# Altium schematic sheet 2008_SablierElectronique_SCH.SchDoc
size A3; Version: A; Author: Carlos  Reyes Peña; Organization: ETML-ES; Address1: Avenue Recordon 1; Address2: 1004 Lausanne; Address3: Switzerland; Revision: 1; SheetNumber: 1; SheetTotal: 4
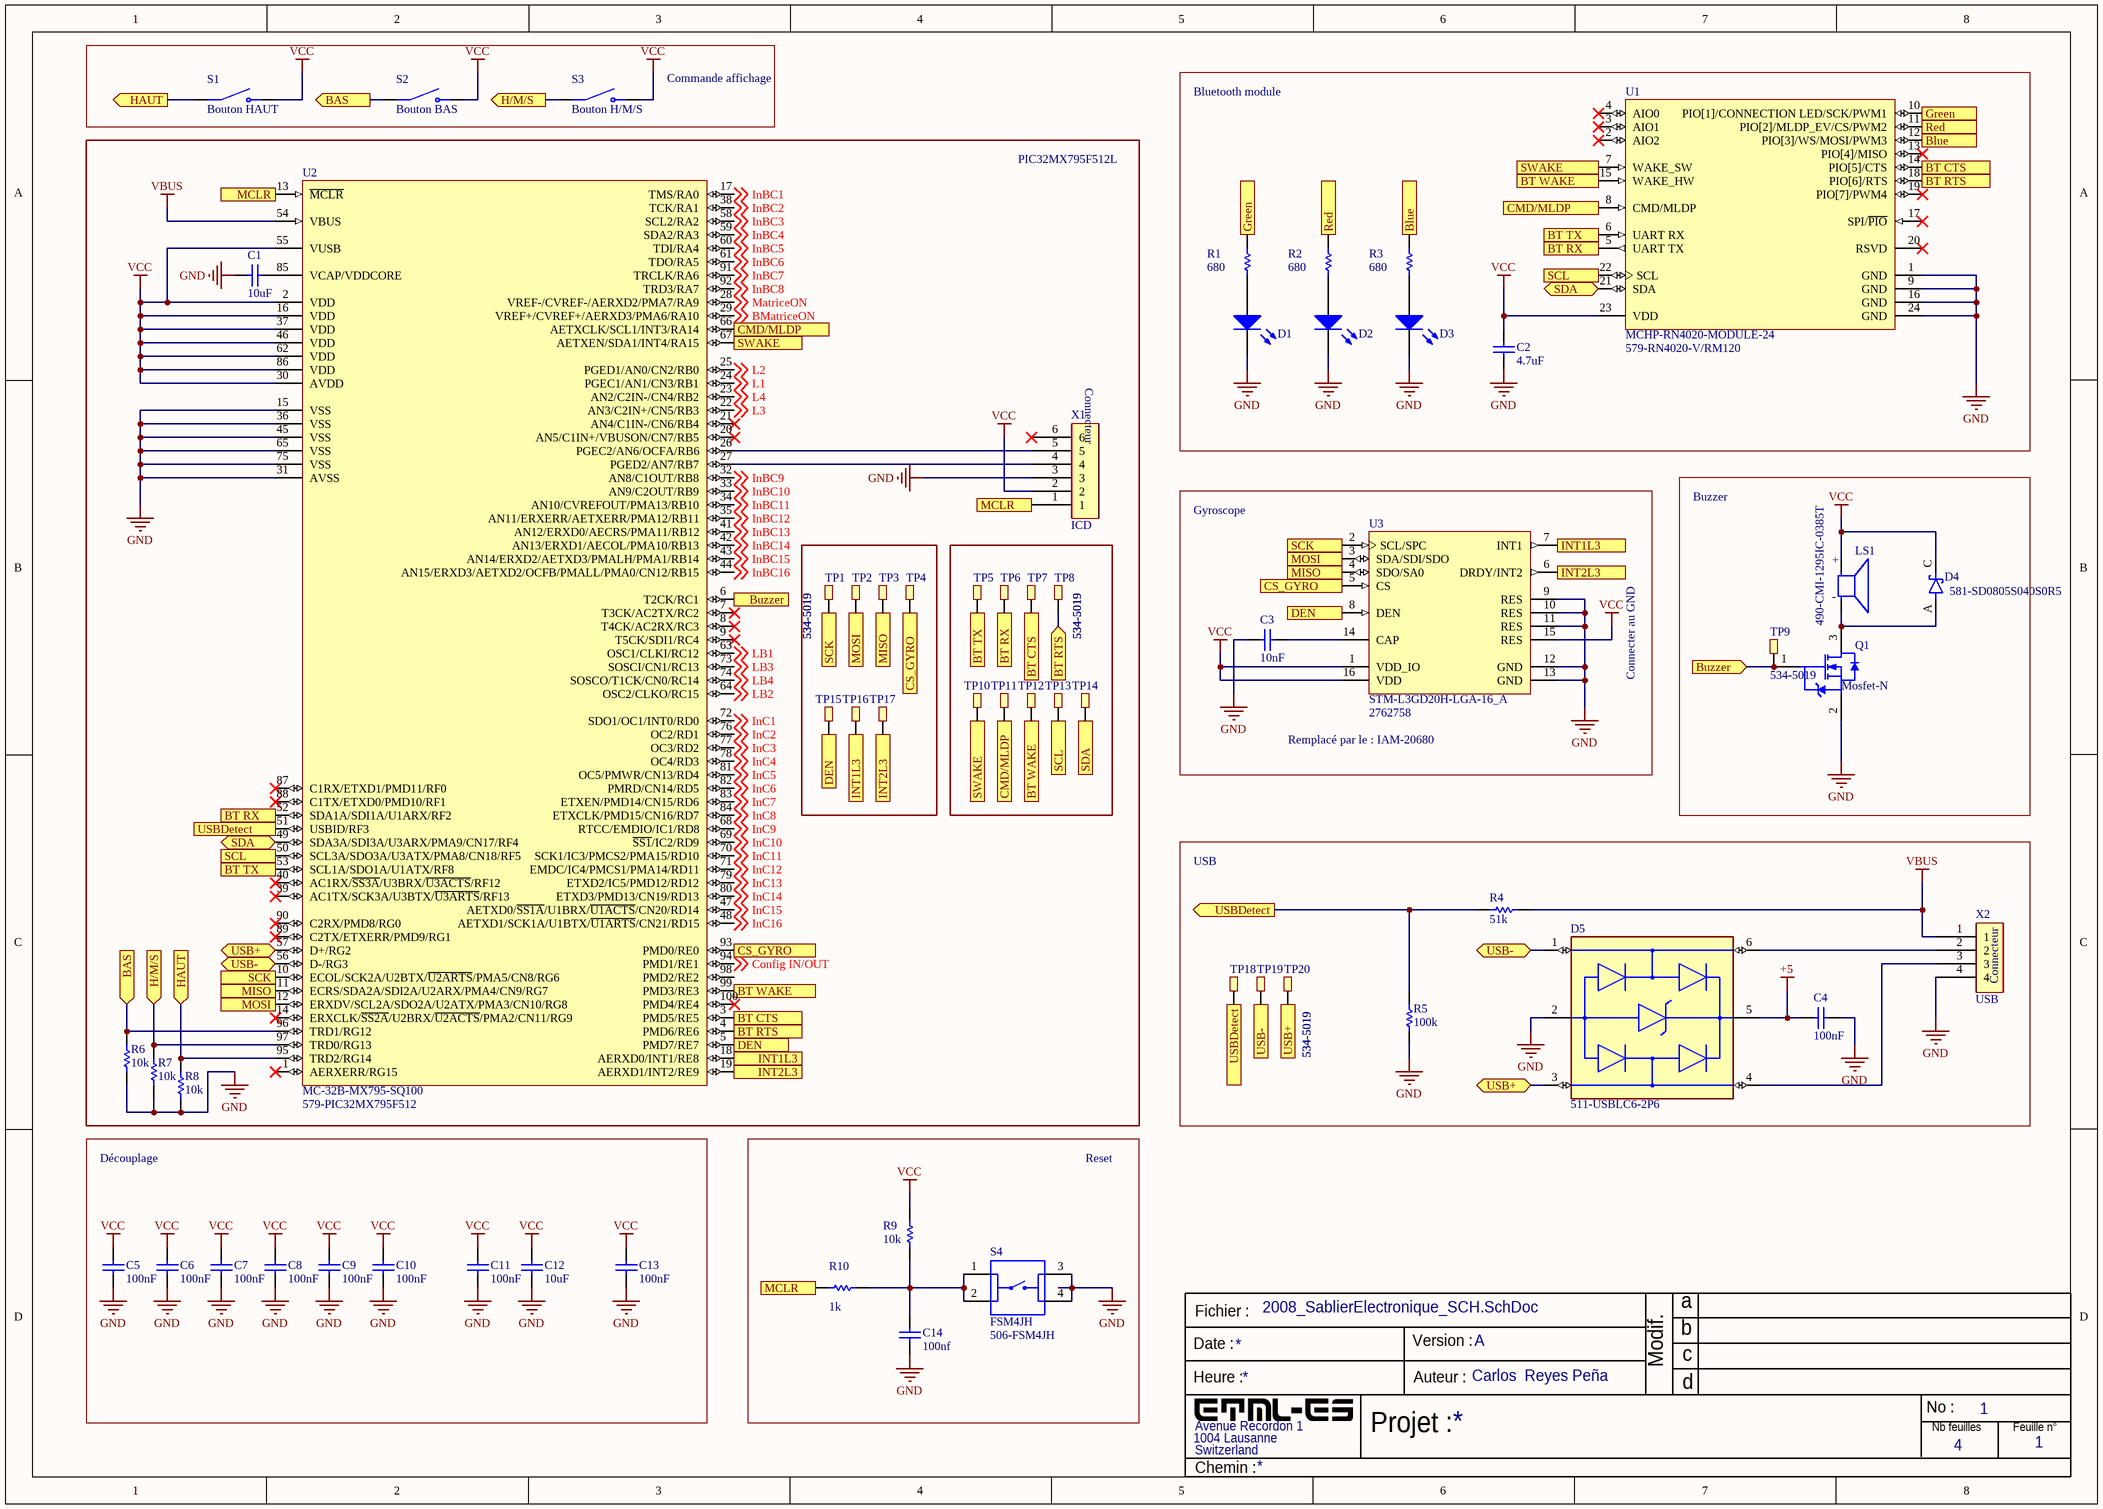
[diagram p0: 2008_SablierElectronique_SCH.SchDoc]

## Parts
C1  10uF  [RESC0805(2012)_L]
C2  4.7uF  [RESC0805(2012)_L]
C3  10nF  [RESC0805(2012)_L]
C4  100nF  [RESC0805(2012)_L]
C5  100nF  [RESC0805(2012)_L]
C6  100nF  [RESC0805(2012)_L]
C7  100nF  [RESC0805(2012)_L]
C8  100nF  [RESC0805(2012)_L]
C9  100nF  [RESC0805(2012)_L]
C10  100nF  [RESC0805(2012)_L]
C11  100nF  [RESC0805(2012)_L]
C12  10uF  [RESC0805(2012)_L]
C13  100nF  [RESC0805(2012)_L]
C14  100nf  [RESC0805(2012)_L]
D1  KPT-2012SRC-PRV  [0805_LED]  (value not drawn)
D2  KPT-2012SRC-PRV  [0805_LED]  (value not drawn)
D3  KPT-2012SRC-PRV  [0805_LED]  (value not drawn)
D4  Supplier Part Number 1: 581-SD0805S040S0R5  [DIOSC130X200X100-2N]  (hidden comment: SD0805S040S0R1)
D5  Supplier Part Number 1: 511-USBLC6-2P6  [FP-SOT-666-MFG]  (hidden comment: USBLC6-2P6)
LS1  Supplier Part Number 1: 490-CMI-1295IC-0385T  [CUI_CMI-1295IC-0385T]  (hidden comment: CMI-1295IC-0385T)
Q1  Mosfet-N  [FAIR-SOT23-3_V]
R1  680  [RESC0805(2012)_L]
R2  680  [RESC0805(2012)_L]
R3  680  [RESC0805(2012)_L]
R4  51k  [RESC0805(2012)_L]
R5  100k  [RESC0805(2012)_L]
R6  10k  [RESC0805(2012)_L]
R7  10k  [RESC0805(2012)_L]
R8  10k  [RESC0805(2012)_L]
R9  10k  [RESC0805(2012)_L]
R10  1k  [RESC0805(2012)_L]
S1  Bouton HAUT  [Header 2 pin]
S2  Bouton BAS  [Header 2 pin]
S3  Bouton H/M/S  [Header 2 pin]
S4  FSM4JH  Supplier Part Number 1: 506-FSM4JH  [SW_FSM4JH]
TP1  Supplier Part Number 1: 534-5019  [TESTPOINT_SMD]  (hidden comment: 5019)
TP2  Supplier Part Number 1: 534-5019  [TESTPOINT_SMD]  (hidden comment: 5019)
TP3  Supplier Part Number 1: 534-5019  [TESTPOINT_SMD]  (hidden comment: 5019)
TP4  Supplier Part Number 1: 534-5019  [TESTPOINT_SMD]  (hidden comment: 5019)
TP5  Supplier Part Number 1: 534-5019  [TESTPOINT_SMD]  (hidden comment: 5019)
TP6  Supplier Part Number 1: 534-5019  [TESTPOINT_SMD]  (hidden comment: 5019)
TP7  Supplier Part Number 1: 534-5019  [TESTPOINT_SMD]  (hidden comment: 5019)
TP8  Supplier Part Number 1: 534-5019  [TESTPOINT_SMD]  (hidden comment: 5019)
TP9  Supplier Part Number 1: 534-5019  [TESTPOINT_SMD]  (hidden comment: 5019)
TP10  5019  [TESTPOINT_SMD_Via]  (value not drawn)
TP11  5019  [TESTPOINT_SMD_Via]  (value not drawn)
TP12  5019  [TESTPOINT_SMD_Via]  (value not drawn)
TP13  5019  [TESTPOINT_SMD_Via]  (value not drawn)
TP14  5019  [TESTPOINT_SMD_Via]  (value not drawn)
TP15  5019  [TESTPOINT_SMD_Via]  (value not drawn)
TP16  5019  [TESTPOINT_SMD_Via]  (value not drawn)
TP17  5019  [TESTPOINT_SMD_Via]  (value not drawn)
TP18  Supplier Part Number 1: 534-5019  [TESTPOINT_SMD]  (hidden comment: 5019)
TP19  Supplier Part Number 1: 534-5019  [TESTPOINT_SMD]  (hidden comment: 5019)
TP20  Supplier Part Number 1: 534-5019  [TESTPOINT_SMD]  (hidden comment: 5019)
U1  MCHP-RN4020-MODULE-24  Supplier Part Number 1: 579-RN4020-V/RM120  [MCHP-MODULE-24_V]
U2  MC-32B-MX795-SQ100  Supplier Part Number 1: 579-PIC32MX795F512  [TQFP-PT100_N]
U3  STM-L3GD20H-LGA-16_A  Supplier Part Number 1: 2762758  [STM-LGA-16]
X1  ICD  [CON6]
X2  USB  [CON4]

## Blocks framed on the sheet
Commande affichage: S1-S3
Bluetooth module: C2 D1-D3 R1-R3 U1
PIC32MX795F512L: C1 R6-R8 TP1-TP8 TP10-TP17 U2 X1
Buzzer: D4 LS1 Q1 TP9
USB: C4 D5 R4 R5 TP18-TP20 X2
Découplage: C5-C13
Reset: C14 R9 R10 S4

## Ports
BAS (in), BAS (out), Blue (in), Blue (out), BT CTS (in), BT CTS (out), BT RTS (in), BT RTS (out), BT RX (in), BT RX (out), BT TX (in), BT TX (out), BT WAKE (in), BT WAKE (out), Buzzer (in), Buzzer (out), CMD/MLDP (in), CMD/MLDP (out), CS_GYRO (in), CS_GYRO (out), DEN (in), DEN (out), Green (in), Green (out), H/M/S (in), H/M/S (out), HAUT (in), HAUT (out), INT1L3 (in), INT1L3 (out), INT2L3 (in), INT2L3 (out), MCLR (in), MCLR (out), MISO (in), MISO (out), MOSI (in), MOSI (out), Red (in), Red (out), SCK (in), SCK (out), SCL (in), SCL (out), SDA (bidir), SDA (in), SWAKE (in), SWAKE (out), USB+ (bidir), USB+ (in), USB- (bidir), USB- (in), USBDetect (in), USBDetect (out)

## Nets
+5: C4.2 D5.5(VBUS)
GND: C1.2 C2.1 C3.1 C4.1 C5.1 C6.1 C7.1 C8.1 C9.1 C10.1 C11.1 C12.1 C13.1 C14.1 D1.1(K) D2.1(K) D3.1(K) D5.2(GND) Q1.2(S) R5.2 R6.2 R7.2 R8.2 S4.3 S4.4 U1.1(GND) U1.9(GND) U1.16(GND) U1.24(GND) U2.15(VSS) U2.31(AVSS) U2.36(VSS) U2.45(VSS) U2.65(VSS) U2.75(VSS) U3.9(RES) U3.10(RES) U3.11(RES) U3.12(GND) U3.13(GND) X1.3 X2.4
VBUS: R4.2 U2.54(VBUS) X2.1
VCC: C2.2 C5.2 C6.2 C7.2 C8.2 C9.2 C10.2 C11.2 C12.2 C13.2 D4.C(K) LS1.P R9.1 S1.2 S2.2 S3.2 U1.23(VDD) U2.2(VDD) U2.16(VDD) U2.30(AVDD) U2.37(VDD) U2.46(VDD) U2.55(VUSB) U2.62(VDD) U2.86(VDD) U3.1(VDD_IO) U3.15(RES) U3.16(VDD) X1.2
BAS: R6.1 S2.1 U2.96(TRD1/RG12) ; port BAS
Blue: R3.1 U1.12(PIO[3]/WS/MOSI/PWM3) ; port Blue
BMatriceON: U2.29(VREF+/CVREF+/AERXD3/PMA6/RA10) ; off-sheet BMatriceON
BT CTS: TP7.1 U1.14(PIO[5]/CTS) U2.3(PMD5/RE5) ; port BT CTS
BT RTS: TP8.1 U1.18(PIO[6]/RTS) U2.4(PMD6/RE6) ; port BT RTS
BT RX: TP6.1 U1.5(UART_TX) U2.52(SDA1A/SDI1A/U1ARX/RF2) ; port BT RX
BT TX: TP5.1 U1.6(UART_RX) U2.53(SCL1A/SDO1A/U1ATX/RF8) ; port BT TX
BT WAKE: TP12.1 U1.15(WAKE_HW) U2.99(PMD3/RE3) ; port BT WAKE
Buzzer: Q1.1(G) TP9.1 U2.6(T2CK/RC1) ; port Buzzer
CMD/MLDP: TP11.1 U1.8(CMD/MLDP) U2.66(AETXCLK/SCL1/INT3/RA14) ; port CMD/MLDP
Config IN/OUT: U2.94(PMD1/RE1) ; off-sheet Config IN/OUT
CS_GYRO: TP4.1 U2.93(PMD0/RE0) U3.5(CS) ; port CS_GYRO
DEN: TP15.1 U2.5(PMD7/RE7) U3.8(DEN) ; port DEN
Green: R1.1 U1.10(PIO[1]/CONNECTION_LED/SCK/PWM1) ; port Green
H/M/S: R7.1 S3.1 U2.97(TRD0/RG13) ; port H/M/S
HAUT: R8.1 S1.1 U2.95(TRD2/RG14) ; port HAUT
InBC1: U2.17(TMS/RA0) ; off-sheet InBC1
InBC2: U2.38(TCK/RA1) ; off-sheet InBC2
InBC3: U2.58(SCL2/RA2) ; off-sheet InBC3
InBC4: U2.59(SDA2/RA3) ; off-sheet InBC4
InBC5: U2.60(TDI/RA4) ; off-sheet InBC5
InBC6: U2.61(TDO/RA5) ; off-sheet InBC6
InBC7: U2.91(TRCLK/RA6) ; off-sheet InBC7
InBC8: U2.92(TRD3/RA7) ; off-sheet InBC8
InBC9: U2.32(AN8/C1OUT/RB8) ; off-sheet InBC9
InBC10: U2.33(AN9/C2OUT/RB9) ; off-sheet InBC10
InBC11: U2.34(AN10/CVREFOUT/PMA13/RB10) ; off-sheet InBC11
InBC12: U2.35(AN11/ERXERR/AETXERR/PMA12/RB11) ; off-sheet InBC12
InBC13: U2.41(AN12/ERXD0/AECRS/PMA11/RB12) ; off-sheet InBC13
InBC14: U2.42(AN13/ERXD1/AECOL/PMA10/RB13) ; off-sheet InBC14
InBC15: U2.43(AN14/ERXD2/AETXD3/PMALH/PMA1/RB14) ; off-sheet InBC15
InBC16: U2.44(AN15/ERXD3/AETXD2/OCFB/PMALL/PMA0/CN12/RB15) ; off-sheet InBC16
InC1: U2.72(SDO1/OC1/INT0/RD0) ; off-sheet InC1
InC2: U2.76(OC2/RD1) ; off-sheet InC2
InC3: U2.77(OC3/RD2) ; off-sheet InC3
InC4: U2.78(OC4/RD3) ; off-sheet InC4
InC5: U2.81(OC5/PMWR/CN13/RD4) ; off-sheet InC5
InC6: U2.82(PMRD/CN14/RD5) ; off-sheet InC6
InC7: U2.83(ETXEN/PMD14/CN15/RD6) ; off-sheet InC7
InC8: U2.84(ETXCLK/PMD15/CN16/RD7) ; off-sheet InC8
InC9: U2.68(RTCC/EMDIO/IC1/RD8) ; off-sheet InC9
InC10: U2.69(~{SS1}/IC2/RD9) ; off-sheet InC10
InC11: U2.70(SCK1/IC3/PMCS2/PMA15/RD10) ; off-sheet InC11
InC12: U2.71(EMDC/IC4/PMCS1/PMA14/RD11) ; off-sheet InC12
InC13: U2.79(ETXD2/IC5/PMD12/RD12) ; off-sheet InC13
InC14: U2.80(ETXD3/PMD13/CN19/RD13) ; off-sheet InC14
InC15: U2.47(AETXD0/~{SS1A}/U1BRX/~{U1ACTS}/CN20/RD14) ; off-sheet InC15
InC16: U2.48(AETXD1/SCK1A/U1BTX/~{U1ARTS}/CN21/RD15) ; off-sheet InC16
INT1L3: TP16.1 U2.18(AERXD0/INT1/RE8) U3.7(INT1) ; port INT1L3
INT2L3: TP17.1 U2.19(AERXD1/INT2/RE9) U3.6(DRDY/INT2) ; port INT2L3
L1: U2.24(PGEC1/AN1/CN3/RB1) ; off-sheet L1
L2: U2.25(PGED1/AN0/CN2/RB0) ; off-sheet L2
L3: U2.22(AN3/C2IN+/CN5/RB3) ; off-sheet L3
L4: U2.23(AN2/C2IN-/CN4/RB2) ; off-sheet L4
LB1: U2.63(OSC1/CLKI/RC12) ; off-sheet LB1
LB2: U2.64(OSC2/CLKO/RC15) ; off-sheet LB2
LB3: U2.73(SOSCI/CN1/RC13) ; off-sheet LB3
LB4: U2.74(SOSCO/T1CK/CN0/RC14) ; off-sheet LB4
MatriceON: U2.28(VREF-/CVREF-/AERXD2/PMA7/RA9) ; off-sheet MatriceON
MCLR: R10.2 U2.13(~{MCLR}) X1.1 ; port MCLR
MISO: TP3.1 U2.11(ECRS/SDA2A/SDI2A/U2ARX/PMA4/CN9/RG7) U3.4(SDO/SA0) ; port MISO
MOSI: TP2.1 U2.12(ERXDV/SCL2A/SDO2A/U2ATX/PMA3/CN10/RG8) U3.3(SDA/SDI/SDO) ; port MOSI
Red: R2.1 U1.11(PIO[2]/MLDP_EV/CS/PWM2) ; port Red
SCK: TP1.1 U2.10(ECOL/SCK2A/U2BTX/~{U2ARTS}/PMA5/CN8/RG6) U3.2(SCL/SPC) ; port SCK
SCL: TP13.1 U1.22(SCL) U2.50(SCL3A/SDO3A/U3ATX/PMA8/CN18/RF5) ; port SCL
SDA: TP14.1 U1.21(SDA) U2.49(SDA3A/SDI3A/U3ARX/PMA9/CN17/RF4) ; port SDA
SWAKE: TP10.1 U1.7(WAKE_SW) U2.67(AETXEN/SDA1/INT4/RA15) ; port SWAKE
USB+: D5.3(I/O2) TP20.1 U2.57(D+/RG2) ; port USB+
USB-: D5.1(I/O1) TP19.1 U2.56(D-/RG3) ; port USB-
USBDetect: R4.1 R5.1 TP18.1 U2.51(USBID/RF3) ; port USBDetect
NetC1_1: C1.1 U2.85(VCAP/VDDCORE)
NetC3_2: C3.2 U3.14(CAP)
NetC14_2: C14.2 R9.2 R10.1 S4.1 S4.2
NetD1_2: D1.2(A) R1.2
NetD2_2: D2.2(A) R2.2
NetD3_2: D3.2(A) R3.2
NetD4_A: D4.A LS1.N Q1.3(D)
NetD5_4: D5.4(I/O2) X2.3
NetD5_6: D5.6(I/O1) X2.2
NetU2_26: U2.26(PGEC2/AN6/OCFA/RB6) X1.5
NetU2_27: U2.27(PGED2/AN7/RB7) X1.4

Not connected (* = marked no-connect by the designer): U1 2(AIO2)* 3(AIO1)* 4(AIO0)* 13(PIO[4]/MISO)* 17(SPI/~{PIO})* 19(PIO[7]/PWM4)* 20(RSVD)*; U2 1(AERXERR/RG15)* 7(T3CK/AC2TX/RC2)* 8(T4CK/AC2RX/RC3)* 9(T5CK/SDI1/RC4)* 14(ERXCLK/~{SS2A}/U2BRX/~{U2ACTS}/PMA2/CN11/RG9)* 20(AN5/C1IN+/VBUSON/CN7/RB5)* 21(AN4/C1IN-/CN6/RB4)* 39(AC1TX/SCK3A/U3BTX/~{U3ARTS}/RF13)* 40(AC1RX/~{SS3A}/U3BRX/~{U3ACTS}/RF12)* 87(C1RX/ETXD1/PMD11/RF0)* 88(C1TX/ETXD0/PMD10/RF1)* 89(C2TX/ETXERR/PMD9/RG1)* 90(C2RX/PMD8/RG0)* 98(PMD2/RE2) 100(PMD4/RE4)*; X1 6*

## Notes on the sheet
- Gyroscope
- Connecter au GND
- Remplacé par le : IAM-20680
- Fichier :
- a
- Date :
- Heure :
- Version :
- Auteur :
- Modif.
- b
- c
- d
- Projet :
- No :
- Nb feuilles
- Feuille n°
- Chemin :
- (in symbol CMI-1295IC-0385T) +; -
- (in symbol Header 4 pin) Connecteur
- (in symbol Header 6 pins) Connecteur

## Library data of the parts
C1-C14 = CAP1206
D4 = SD0805S040S0R1: Diode Schottky 40V 100mA (DC) Surface Mount 0805 (2012 Metric); MF: AVX; DigiKey-Purchase-URL: https://snapeda.com/shop?store=DigiKey&id=809038; Arrow_Electronics-Purchase-URL: https://snapeda.com/shop?store=Arrow+Electronics&id=809038; Availability: Good; Price: None; Value: *; SnapEDA_Link: https://www.snapeda.com/parts/SD0805S040S0R1/AVX/view-part/809038/?ref=snap; MP: SD0805S040S0R1; Package: 0805 AVX; Mouser-Purchase-URL: https://snapeda.com/shop?store=Mouser&id=809038; Supplier 1: Mouser
LS1 = CMI-1295IC-0385T: 12 mm, 3 Vdc, 85 dB, Through Hole, Driving Circuit, Magnetic Audio Indicator Buzzer; MF: CUI Devices; Price: None; Value: *; Package: Package; Availability: Unavailable; SnapEDA_Link: https://www.snapeda.com/parts/CMI-1295IC-0385T/CUI%20Devices/view-part/4413411/?ref=snap; MP: CMI-1295IC-0385T; Supplier 1: Mouser
Q1 = NEMOS-GSD-3_D
R1-R10 = RES
S1-S3 = Switch SMD: Switch Surface Mount; MP: PTS526 SM08 SMTR2 LFS; MF: C&K; Price: None; Value: *; Package: None; SnapEDA_Link: https://www.snapeda.com/parts/PTS526%20SM08%20SMTR2%20LFS/C&K/view-part/4000306/?ref=snap; Availability: Unavailable
S4 = FSM4JH: Switch Push Button OFF _ON_ SPST Round Button 0.05A 24VDC Momentary Contact PC Pins Thru-Hole; Configuration_Pole-Throw: Single Pole - Single Throw; MF: TE Connectivity; Contact_Current_Rating: 50 mA; MP: 1825910-6; Digi-Key_Purchase_URL: https://www.digikey.com/product-detail/en/te-connectivity-alcoswitch-switches/1825910-6/450-1650-ND/1632536?utm_source=snapeda&utm_medium=aggregator&utm_campaign=symbol; TE_purchase_URL: https://www.te.com/usa-en/product-1825910-6.html?te_bu=Cor&te_type=disp&te_campaign=seda_glo_cor-seda-global-disp-prtnr-fy19-seda-model-bom-cta_sma-317_1&elqCampaignId=32493; Value: *; Digi-Key_Part_Number: 450-1650-ND; SnapEDA_Link: https://www.snapeda.com/parts/1825910-6/TE%20Connectivity%20ALCOSWITCH%20Switches/view-part/424522/?ref=snap; EU_RoHS_Compliance: Compliant; Package: None; Supplier 1: Mouser
TP1-TP9 TP18-TP20 = TESTPOINT: Test point smd; Supplier 1: Mouser
TP10-TP17 = TESTPOINT_via: Test point smd
X1 = Header 6 pins
X2 = Header 4 pin
D5 = USBLC6-2P6: Supplier 1: Mouser
U1 = MCHP-RN4020-MODULE-24: Supplier 1: Mouser
U2 = MC-32B-MX795-SQ100: Supplier 1: Mouser
U3 = STM-L3GD20H-LGA-16_A: Supplier 1: Farnell